# Altium schematic sheet PNY-07006.SchDoc
size A4
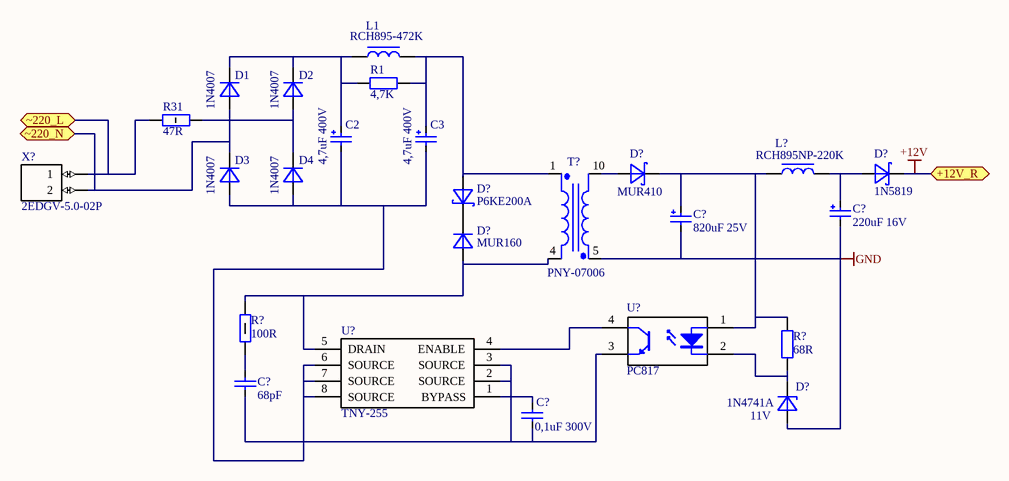
[diagram p0: PNY-07006.SchDoc]

## Parts
(Parts that share a designator on the sheet are numbered #1, #2 ... from top to bottom, then left to right.)
C2  4,7uF 400V  [10x16]
C3  4,7uF 400V  [10x16]
C?#1  220uF 16V  [8x11]
C?#2  820uF 25V  [10x16]
C?#3  68pF  [MPX_P5]
C?#4  0,1uF 300V  [MPX_P10]
D1  1N4007  [DO-41_Vertical]
D2  1N4007  [DO-41_Vertical]
D3  1N4007  [DO-41_Vertical]
D4  1N4007  [DO-41_Vertical]
D?#1  MUR410  [DO-201_Vertical]
D?#2  1N5819  [DO-41_Vertical]
D?#3  P6KE200A  [DO-15_Vertical]
D?#4  MUR160  [DO-41_Vertical]
D?#5  1N4741A  [DO-41]
L1  RCH895-472K  [RCH-895]
L?  RCH895NP-220K  [RCH-895]
R1  value 4,7K  [R_1206]  (hidden comment: Resistor 1206)
R31  value 47R  [Resistor 1W_Vertical]  (hidden comment: Resistor 1W)
R?#1  value 100R  [Resistor  0.5W_Vertical]  (hidden comment: Resistor 0.5W)
R?#2  value 68R  [R_1206]  (hidden comment: Resistor 1206)
T?  PNY-07006  [PNY-07006R]
U?#1  PC817  [DIP-4]
U?#2  TNY-255  [DIP-8]
X?  2EDGV-5.0-02P  [2EDGV-5.0-02P]

## Ports
+12V_R, ~220_L, ~220_N

## Nets
+12V: D?#2.2(C) ; port +12V_R
GND: C?#1.2 C?#2.2 D?#5.1(A) T?.5(5V_RETURN)
~220_L: R31.1 X?.1 ; port ~220_L
~220_N: D1.1(A) D3.2(C) X?.2 ; port ~220_N
NetC2_1: C2.1 D1.2(C) D2.2(C) L1.2 R1.1
NetC2_2: C2.2 C3.2 C?#3.1 C?#4.2 D3.1(A) D4.1(A) U?#1.3(E) U?#2.2(SOURCE) U?#2.3(SOURCE) U?#2.6(SOURCE) U?#2.7(SOURCE) U?#2.8(SOURCE)
NetC3_1: C3.1 D?#3.1(A) L1.1 R1.2 T?.1(HOT_RAIL)
NetC?#1_1: C?#1.1 D?#2.1(A) L?.1
NetC?#2_1: C?#2.1 D?#1.2(C) L?.2 R?#2.2 U?#1.1(A)
NetC?#3_2: C?#3.2 R?#1.1
NetC?#4_1: C?#4.1 U?#2.1(BYPASS)
NetD2_1: D2.1(A) D4.2(C) R31.2
NetD?#1_1: D?#1.1(A) T?.10(+5V)
NetD?#3_2: D?#3.2(C) D?#4.2(C)
NetD?#4_1: D?#4.1(A) R?#1.2 T?.4(DRAIN) U?#2.5(DRAIN)
NetD?#5_2: D?#5.2(C) R?#2.1 U?#1.2(K)
NetU?#1_4: U?#1.4(C) U?#2.4(ENABLE)

## Notes on the sheet
- (near D?#5) 11V

## Library data of the parts
C2 C3 C?#1 C?#2 = Capacitor Polar
C?#3 C?#4 = Cap_Semi: Capacitor semi
D1-D4 = 1N4007: Diode
D?#1 = MUR410: Diode Ultrafast
D?#2 = 1N5819: Diode Schottky
D?#3 = P6KE200A: Diode Schottky
D?#4 = MUR160: Diode fast
D?#5 = 1N4741A: Zener Diode
L1 L? = Induction
U?#1 = PC817: Optocoupler
U?#2 = TNY-255: Low Power Off-line Switchers
X? = 2EDGV-5.0-02P: Connector 5mm